# EAGLE design dataLink (EAGLE 5.11)
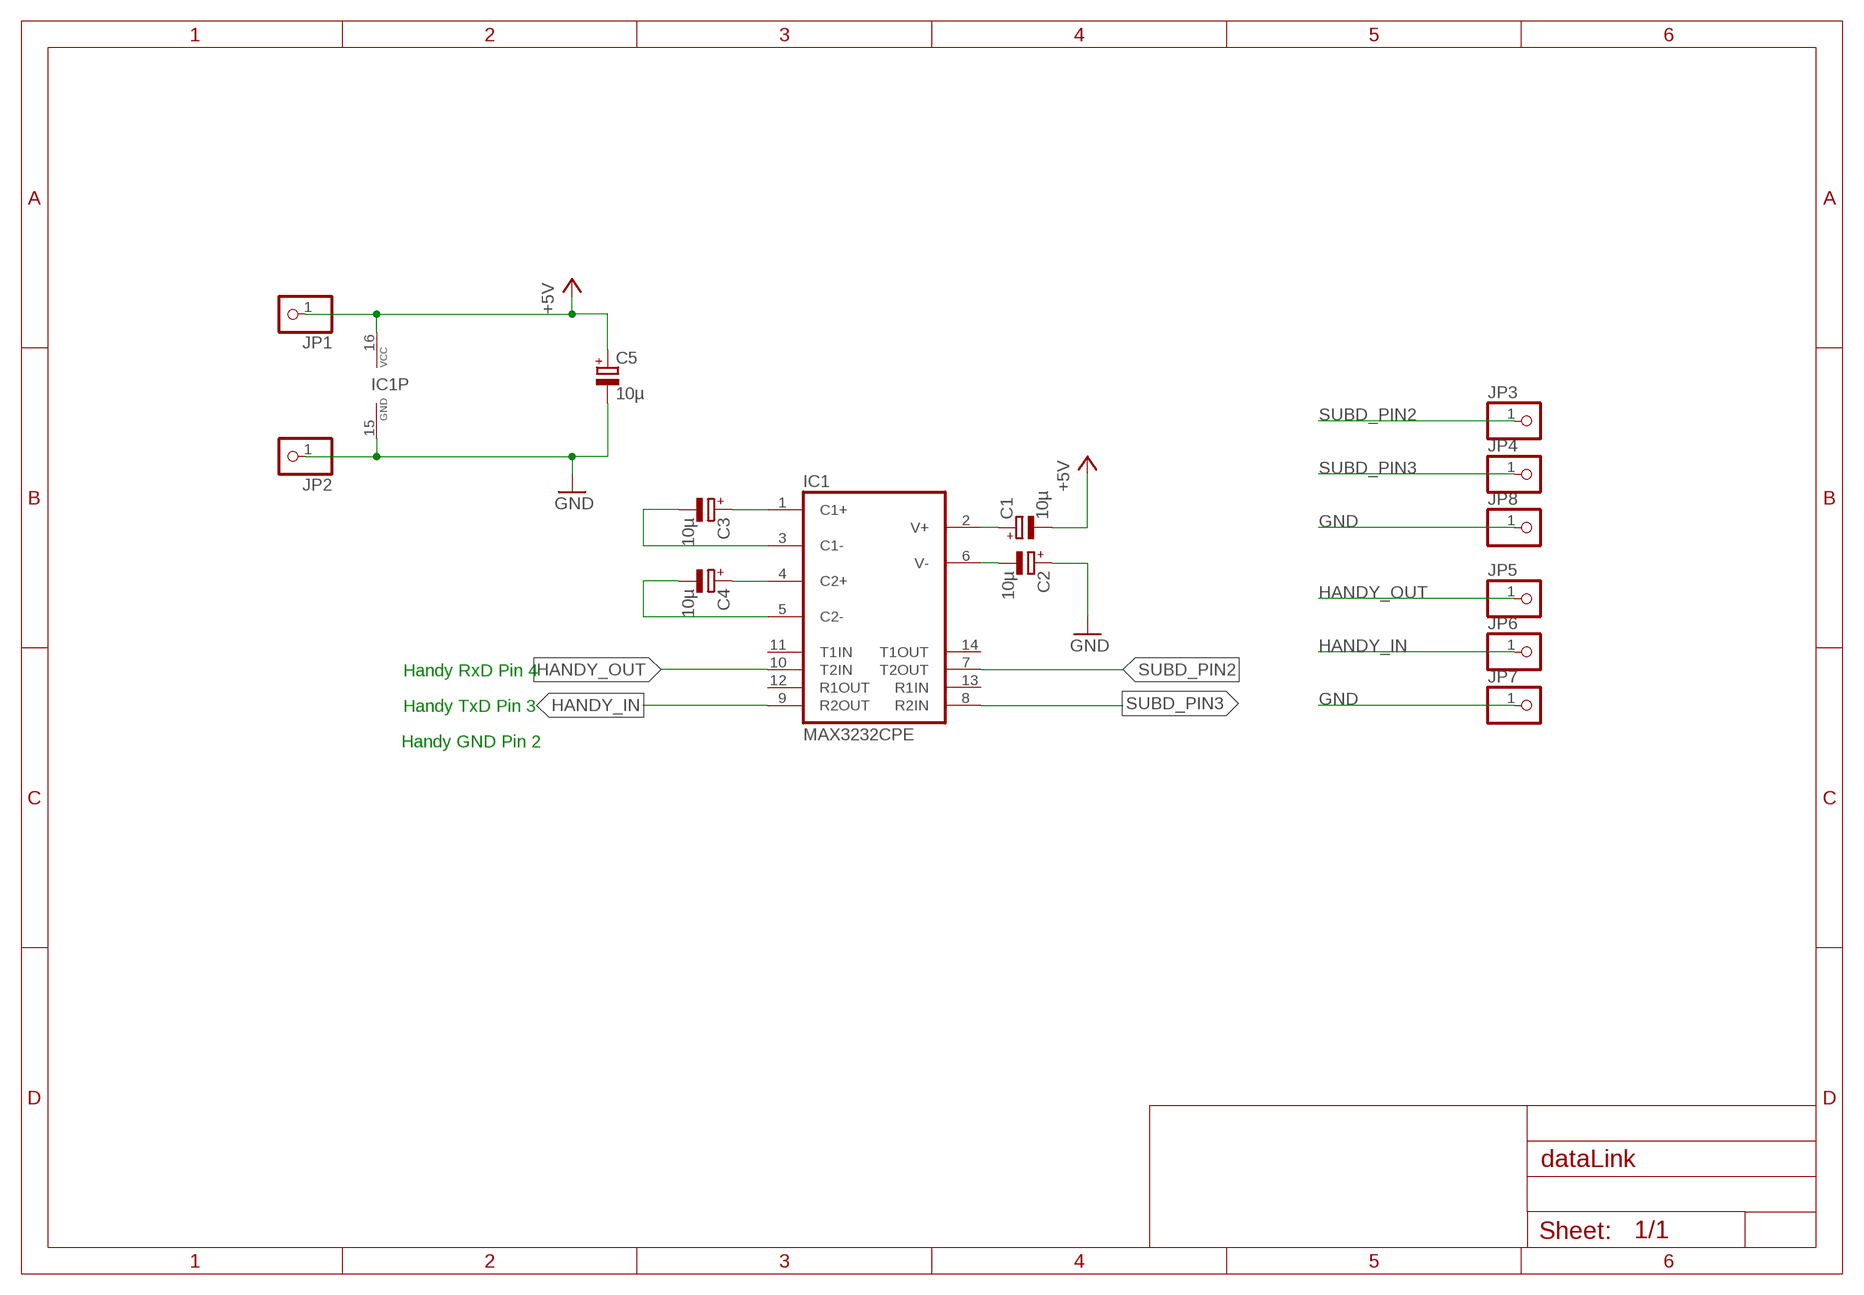
[diagram p0: schematic, sheet 1]

## Parts
C1  10µ  CPOL-EUE2,5-6E  [E2,5-6E]
C2  10µ  CPOL-EUE2,5-6E  [E2,5-6E]
C3  10µ  CPOL-EUE2,5-6E  [E2,5-6E]
C4  10µ  CPOL-EUE2,5-6E  [E2,5-6E]
C5  10µ  CPOL-EUE2,5-6E  [E2,5-6E]
IC1  MAX3232CPE  [DIL16]
JP1  PINHD-1X1  [1X01]
JP2  PINHD-1X1  [1X01]
JP3  PINHD-1X1  [1X01]
JP4  PINHD-1X1  [1X01]
JP5  PINHD-1X1  [1X01]
JP6  PINHD-1X1  [1X01]
JP7  PINHD-1X1  [1X01]
JP8  PINHD-1X1  [1X01]

## Nets
+5V: C1.- C5.+ IC1.16(VCC) JP1.1
GND: C2.+ C5.- IC1.15(GND) JP2.1 JP7.1 JP8.1
HANDY_IN: IC1.9(R2OUT) JP6.1
HANDY_OUT: IC1.10(T2IN) JP5.1
N$1: C1.+ IC1.2(V+)
N$2: C2.- IC1.6(V-)
N$3: C3.+ IC1.1(C1+)
N$4: C3.- IC1.3(C1-)
N$5: C4.+ IC1.4(C2+)
N$6: C4.- IC1.5(C2-)
SUBD_PIN2: IC1.7(T2OUT) JP3.1
SUBD_PIN3: IC1.8(R2IN) JP4.1
Unconnected: IC1.11(T1IN) IC1.12(R1OUT) IC1.13(R1IN) IC1.14(T1OUT)

## Notes on the sheet
- Handy RxD Pin 4
- Handy TxD Pin 3
- Handy GND Pin 2

## Library data of the parts
C1-C5 = rcl:CPOL-EU: POLARIZED CAPACITOR, European symbol
IC1 = maxim:MAX3232*: True RS-232 Transceivers 3.0V to 5.5V, Low-Power up to 1Mbps, Using Four 0.1µF External Capacitors Source: http://pdfserv.maxim-ic.com/en/ds/MAX3222-MAX3241.pdf; MF: MAXIM; MPN: MAX3232CPE+; OC_FARNELL: 9724494; OC_NEWARK: 68K4626
JP1-JP8 = pinhead:PINHD-1X1: PIN HEADER

## Board
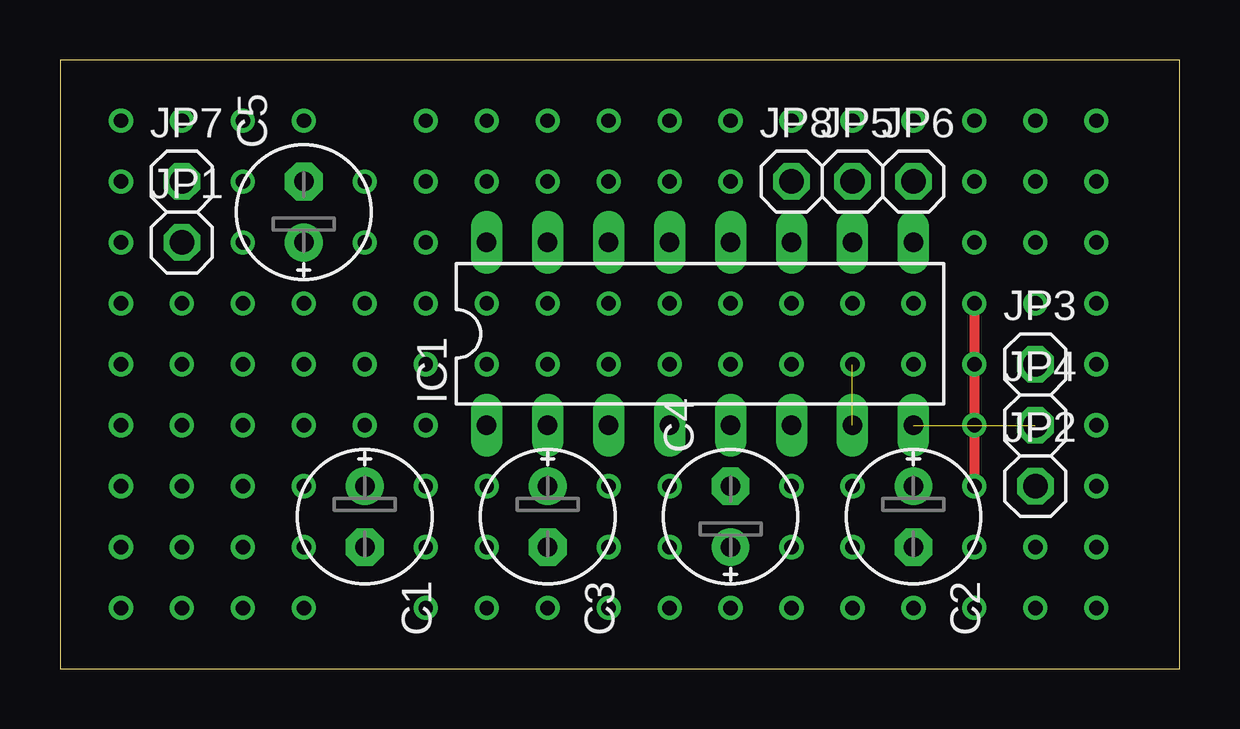
[diagram p1: board, top side]
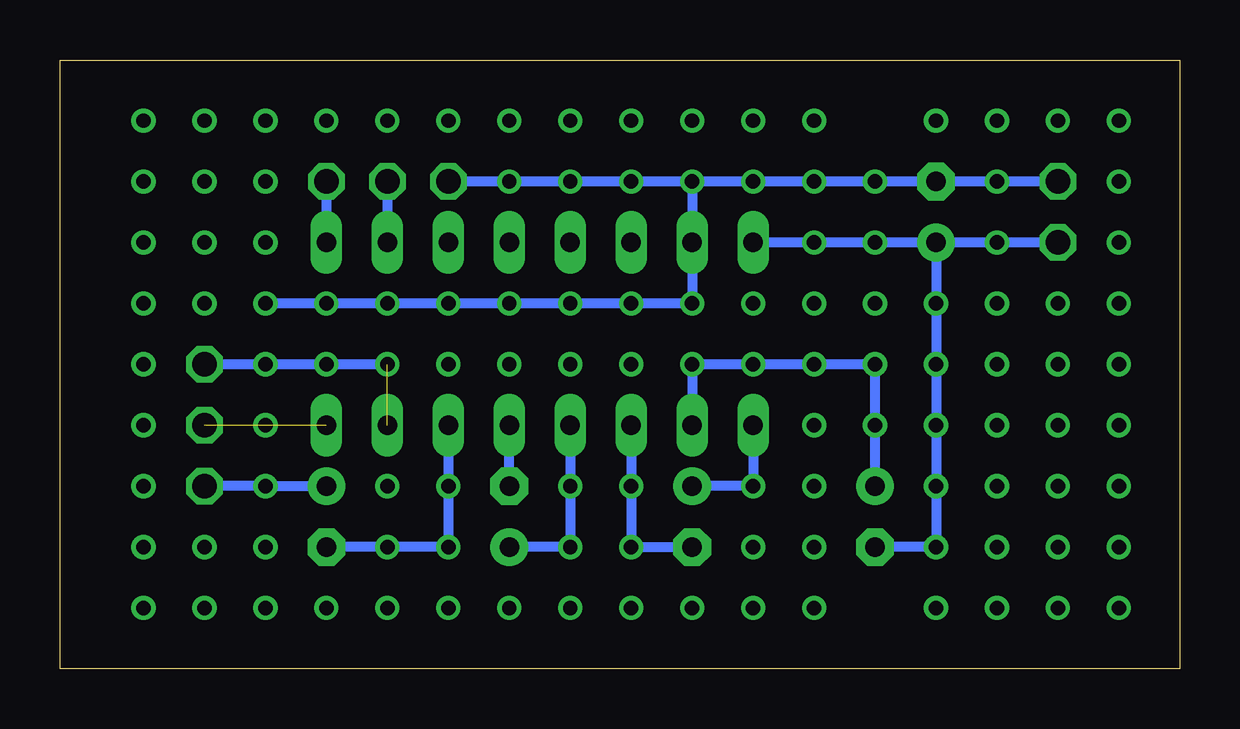
[diagram p2: board, bottom side, seen from below]

Size 46.66 x 25.39 mm. Coordinates in mm from the lower left corner, seen from the top.
Outline: 0,0 46.66,0 46.66,25.39 0,25.39 0,0
Copper layers (1*16): Top 0.035mm / dielectric 1.5mm / Bottom 0.035mm
Design rules "default": minimum track width 10mil, minimum drill 24mil, track to track 8mil, track to pad 8mil, pad to pad 8mil, via to via 8mil, smd to smd 8mil, copper to edge 40mil, drill to drill 8mil, minimum pad ring 10mil, minimum via ring 8mil, stop-mask expansion 4mil, vias tented up to drill 0mil, thermal gap 10mil

### Footprints (pad centres in the part's own frame; a part is rotated, then mirrored left to right if it is on the bottom)
E2,5-6E = drill 0.813 pad 1.575 round: + -1.27,0 | drill 0.813 pad 1.575 octagon: - 1.27,0
DIL16 = drill 0.813 long: 1 -8.89,-3.81; 2 -6.35,-3.81; 3 -3.81,-3.81; 4 -1.27,-3.81; 5 1.27,-3.81; 6 3.81,-3.81; 7 6.35,-3.81; 8 8.89,-3.81; 9 8.89,3.81; 10 6.35,3.81; 11 3.81,3.81; 12 1.27,3.81; 13 -1.27,3.81; 14 -3.81,3.81; 15 -6.35,3.81; 16 -8.89,3.81
1X01 = drill 1.016 octagon: 1 0,0

### Placement (x,y rotation side)
C1  12.7,6.35 270 top
C2  35.56,6.35 270 top
C3  20.32,6.35 270 top
C4  27.94,6.35 90 top
C5  10.16,19.05 90 top
IC1  26.67,13.97 0 top
JP1  5.08,17.78 0 top
JP2  40.64,7.62 0 top
JP3  40.64,12.7 0 top
JP4  40.64,10.16 0 top
JP5  33.02,20.32 0 top
JP6  35.56,20.32 0 top
JP7  5.08,20.32 0 top
JP8  30.48,20.32 0 top

### Tracks (layer width: path | path; a pad name or v marks a point on that pad's centre or on a via)
+5V  (via drill 0.6)
  Bottom 0.406: C5.+ IC1.16 | C5.+ v7.62,17.78 JP1.1 | C5.+ 10.16,5.08 C1.-
GND  (via drill 0.6)
  Top 0.406: v38.1,15.24 v38.1,7.62
  Bottom 0.406: v38.1,15.24 20.32,15.24 IC1.15 20.32,20.32 | JP7.1 v7.62,20.32 C5.- 20.32,20.32 | 20.32,20.32 v25.4,20.32 JP8.1 | JP2.1 v38.1,7.62 C2.+
HANDY_IN
  Bottom 0.406: JP6.1 IC1.9
HANDY_OUT
  Bottom 0.406: JP5.1 IC1.10
N$1  (via drill 0.6)
  Bottom 0.406: IC1.2 v20.32,12.7 v17.78,12.7 v15.24,12.7 v12.7,12.7 v12.7,10.16 C1.+
N$2  (via drill 0.6)
  Bottom 0.406: IC1.6 v30.48,7.62 v30.48,5.08 v33.02,5.08 C2.-
N$3  (via drill 0.6)
  Bottom 0.406: IC1.1 v17.78,7.62 C3.+
N$4  (via drill 0.6)
  Bottom 0.406: IC1.3 v22.86,7.62 v22.86,5.08 C3.-
N$5  (via drill 0.6)
  Bottom 0.406: IC1.4 v25.4,5.08 C4.+
N$6
  Bottom 0.406: C4.- IC1.5
N$7  (via drill 0.6)
  other vias: 17.78,15.24
N$8  (via drill 0.6)
  other vias: 20.32,15.24
N$9  (via drill 0.6)
  other vias: 22.86,15.24
N$10  (via drill 0.6)
  other vias: 22.86,12.7
N$11  (via drill 0.6)
  other vias: 25.4,15.24
N$12  (via drill 0.6)
  other vias: 25.4,12.7
N$13  (via drill 0.6)
  other vias: 27.94,15.24
N$14  (via drill 0.6)
  other vias: 27.94,12.7
N$15  (via drill 0.6)
  other vias: 30.48,15.24
N$16  (via drill 0.6)
  other vias: 30.48,12.7
N$17  (via drill 0.6)
  other vias: 33.02,15.24
N$18  (via drill 0.6)
  other vias: 33.02,12.7
N$19  (via drill 0.6)
  other vias: 35.56,15.24
N$20  (via drill 0.6)
  other vias: 35.56,12.7
N$21  (via drill 0.6)
  other vias: 38.1,17.78
N$22  (via drill 0.6)
  other vias: 43.18,5.08
N$23  (via drill 0.6)
  other vias: 43.18,7.62
N$24  (via drill 0.6)
  other vias: 38.1,10.16
N$25  (via drill 0.6)
  other vias: 15.24,10.16
N$26  (via drill 0.6)
  other vias: 15.24,15.24
N$27  (via drill 0.6)
  other vias: 15.24,17.78
N$28  (via drill 0.6)
  other vias: 12.7,17.78
N$29  (via drill 0.6)
  other vias: 12.7,15.24
N$30  (via drill 0.6)
  other vias: 43.18,10.16
N$31  (via drill 0.6)
  other vias: 43.18,12.7
N$32  (via drill 0.6)
  other vias: 2.54,22.86
N$33  (via drill 0.6)
  other vias: 40.64,17.78
N$34  (via drill 0.6)
  other vias: 40.64,20.32
N$35  (via drill 0.6)
  other vias: 38.1,20.32
N$36  (via drill 0.6)
  other vias: 35.56,22.86
N$37  (via drill 0.6)
  other vias: 33.02,22.86
N$38  (via drill 0.6)
  other vias: 30.48,22.86
N$39  (via drill 0.6)
  other vias: 27.94,20.32
N$40  (via drill 0.6)
  other vias: 25.4,22.86
N$41  (via drill 0.6)
  other vias: 22.86,20.32
N$42  (via drill 0.6)
  other vias: 20.32,20.32
N$43  (via drill 0.6)
  other vias: 17.78,20.32
N$44  (via drill 0.6)
  other vias: 15.24,20.32
N$45  (via drill 0.6)
  other vias: 12.7,20.32
N$46  (via drill 0.6)
  other vias: 15.24,2.54
N$49  (via drill 0.6)
  other vias: 17.78,5.08
N$51  (via drill 0.6)
  other vias: 33.02,2.54
N$52  (via drill 0.6)
  other vias: 15.24,7.62
N$53  (via drill 0.6)
  other vias: 2.54,20.32
N$54  (via drill 0.6)
  other vias: 5.08,15.24
N$55  (via drill 0.6)
  other vias: 7.62,22.86
N$56  (via drill 0.6)
  other vias: 15.24,5.08
N$57  (via drill 0.6)
  other vias: 10.16,15.24
N$58  (via drill 0.6)
  other vias: 7.62,15.24
N$59  (via drill 0.6)
  other vias: 7.62,12.7
N$60  (via drill 0.6)
  other vias: 5.08,12.7
N$61  (via drill 0.6)
  other vias: 10.16,12.7
N$62  (via drill 0.6)
  other vias: 10.16,10.16
N$63  (via drill 0.6)
  other vias: 7.62,10.16
N$64  (via drill 0.6)
  other vias: 5.08,10.16
N$65  (via drill 0.6)
  other vias: 5.08,7.62
N$66  (via drill 0.6)
  other vias: 7.62,7.62
N$67  (via drill 0.6)
  other vias: 10.16,7.62
N$68  (via drill 0.6)
  other vias: 10.16,5.08
N$69  (via drill 0.6)
  other vias: 7.62,5.08
N$70  (via drill 0.6)
  other vias: 5.08,5.08
N$71  (via drill 0.6)
  other vias: 30.48,2.54
N$72  (via drill 0.6)
  other vias: 33.02,7.62
N$73  (via drill 0.6)
  other vias: 20.32,2.54
N$75  (via drill 0.6)
  other vias: 40.64,2.54
N$76  (via drill 0.6)
  other vias: 38.1,12.7
N$77  (via drill 0.6)
  other vias: 35.56,2.54
N$78  (via drill 0.6)
  other vias: 40.64,5.08
N$79  (via drill 0.6)
  other vias: 38.1,5.08
N$80  (via drill 0.6)
  other vias: 38.1,2.54
N$82  (via drill 0.6)
  other vias: 10.16,22.86
N$83  (via drill 0.6)
  other vias: 15.24,22.86
N$84  (via drill 0.6)
  other vias: 17.78,22.86
N$85  (via drill 0.6)
  other vias: 20.32,22.86
N$86  (via drill 0.6)
  other vias: 22.86,22.86
N$87  (via drill 0.6)
  other vias: 27.94,22.86
N$88  (via drill 0.6)
  other vias: 5.08,22.86
N$89  (via drill 0.6)
  other vias: 5.08,2.54
N$90  (via drill 0.6)
  other vias: 2.54,2.54
N$91  (via drill 0.6)
  other vias: 2.54,5.08
N$92  (via drill 0.6)
  other vias: 2.54,7.62
N$93  (via drill 0.6)
  other vias: 2.54,10.16
N$94  (via drill 0.6)
  other vias: 2.54,12.7
N$95  (via drill 0.6)
  other vias: 2.54,15.24
N$96  (via drill 0.6)
  other vias: 43.18,15.24
N$97  (via drill 0.6)
  other vias: 43.18,17.78
N$98  (via drill 0.6)
  other vias: 43.18,20.32
N$99  (via drill 0.6)
  other vias: 43.18,22.86
N$100  (via drill 0.6)
  other vias: 40.64,22.86
N$101  (via drill 0.6)
  other vias: 38.1,22.86
N$103  (via drill 0.6)
  other vias: 22.86,2.54
N$104  (via drill 0.6)
  other vias: 17.78,2.54
N$107  (via drill 0.6)
  other vias: 25.4,7.62
N$108  (via drill 0.6)
  other vias: 7.62,2.54
N$109  (via drill 0.6)
  other vias: 10.16,2.54
N$110  (via drill 0.6)
  other vias: 2.54,17.78
N$111  (via drill 0.6)
  other vias: 43.18,2.54
N$112  (via drill 0.6)
  other vias: 25.4,2.54
N$113  (via drill 0.6)
  other vias: 27.94,2.54
N$114  (via drill 0.6)
  other vias: 40.64,15.24
SUBD_PIN2  (1 unrouted)
  Bottom 0.406: 33.02,12.7 JP3.1
SUBD_PIN3  (1 unrouted)